# Altium project 25E shutdown bord Rev6 - Copy.PrjPcb
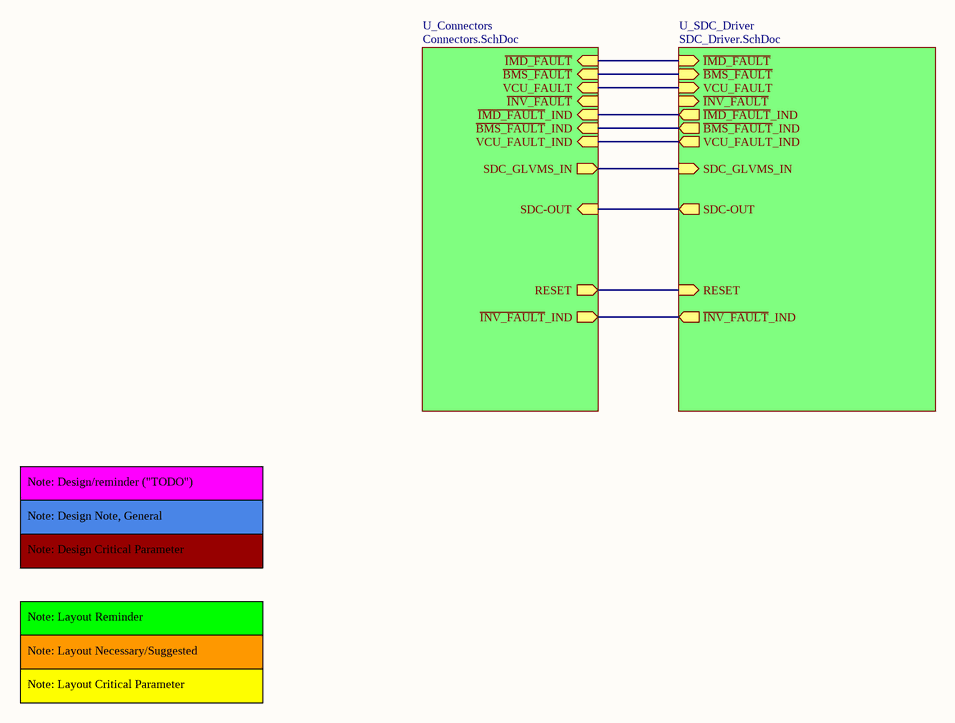
[diagram p0:  Main.SchDoc]
 CAGE_CODE: ?????;  CONTRACT_NUMBER: <CONTRACT NO>;  DOC_NO_ASSY_DWG: <ASSY DWG NO>;  DOC_NO_BOM: <BOM DOC NO>;  DOC_NO_FAB_DWG: <FAB DWG NO>;  DOC_NO_SCH_DWG: <SCH DWG NO>;  PCB_2_DEC_TOL: +/-.01;  PCB_3_DEC_TOL: +/-.010;  PCB_ANG_TOL: +/-1/2;  PCB_ASSEMBLY_NO: <PCB ASSY NO>;  PCB_CHECKER: - -----;  PCB_CHECKER_APP_DATE: --/--/----;  PCB_DESIGNER: - -----;  PCB_DESIGNER_APP_DATE: --/--/----;  PCB_DWG_NO: <PCB DWG NO>;  PCB_ENGINEER: - -----;  PCB_ENGINEER_APP_DATE: --/--/----;  PCB_PART_NUMBER: <PCB PN>;  PCB_REV: A;  SCH_REV: A
6 sheets, 104 parts. Net scope: hierarchical (ports join the sheet entries above them; power ports are global).
Board file:  SCDDB_V_1_0.PcbDoc
Sheets:
   Main.SchDoc
   Connectors.SchDoc
   SDC_Driver.SchDoc
   SDC_Latch_HS.SchDoc
   SDC_LATCH_LS.SchDoc
   Debug.SchDoc

## Sheet  Main.SchDoc
size A; SheetNumber: 1; SheetTotal: 6

### Sub-sheets
U_Connectors = Connectors.SchDoc (file not in this document): ~{IMD_FAULT} (in), ~{BMS_FAULT} (in), VCU_FAULT (in), ~{IMD_FAULT}_IND (in), ~{BMS_FAULT}_IND (in), VCU_FAULT_IND (in), SDC-OUT (in), SDC_GLVMS_IN (out), RESET (out), ~{INV_FAULT} (in), ~{INV_FAULT}_IND (out)
U_SDC_Driver = SDC_Driver.SchDoc (file not in this document): SDC_GLVMS_IN (in), RESET (in), SDC-OUT (out), ~{IMD_FAULT} (in), ~{BMS_FAULT} (in), VCU_FAULT (in), ~{IMD_FAULT}_IND (out), ~{BMS_FAULT}_IND (out), VCU_FAULT_IND (out), ~{INV_FAULT} (in), ~{INV_FAULT}_IND (out)

### Nets
(unnamed): sheet U_Connectors/~{IMD_FAULT}, sheet U_SDC_Driver/~{IMD_FAULT}
(unnamed): sheet U_Connectors/~{BMS_FAULT}, sheet U_SDC_Driver/~{BMS_FAULT}
(unnamed): sheet U_Connectors/VCU_FAULT, sheet U_SDC_Driver/VCU_FAULT
(unnamed): sheet U_Connectors/~{IMD_FAULT}_IND, sheet U_SDC_Driver/~{IMD_FAULT}_IND
(unnamed): sheet U_Connectors/~{BMS_FAULT}_IND, sheet U_SDC_Driver/~{BMS_FAULT}_IND
(unnamed): sheet U_Connectors/VCU_FAULT_IND, sheet U_SDC_Driver/VCU_FAULT_IND
(unnamed): sheet U_Connectors/SDC-OUT, sheet U_SDC_Driver/SDC-OUT
(unnamed): sheet U_Connectors/SDC_GLVMS_IN, sheet U_SDC_Driver/SDC_GLVMS_IN
(unnamed): sheet U_Connectors/RESET, sheet U_SDC_Driver/RESET
(unnamed): sheet U_Connectors/~{INV_FAULT}_IND, sheet U_SDC_Driver/~{INV_FAULT}_IND

### Notes on the sheet
- Note: Design/reminder ("TODO")
- Note: Design Note, General
- Note: Design Critical Parameter
- Note: Layout Reminder
- Note: Layout Necessary/Suggested
- Note: Layout Critical Parameter

## Sheet  Connectors.SchDoc
size 431 x 279 mm; SheetNumber: 2; SheetTotal: 6; ENG_APP_DATE: --/--/--; DSN_APP_DATE: --/--/--; CHK_APP_DATE: --/--/--
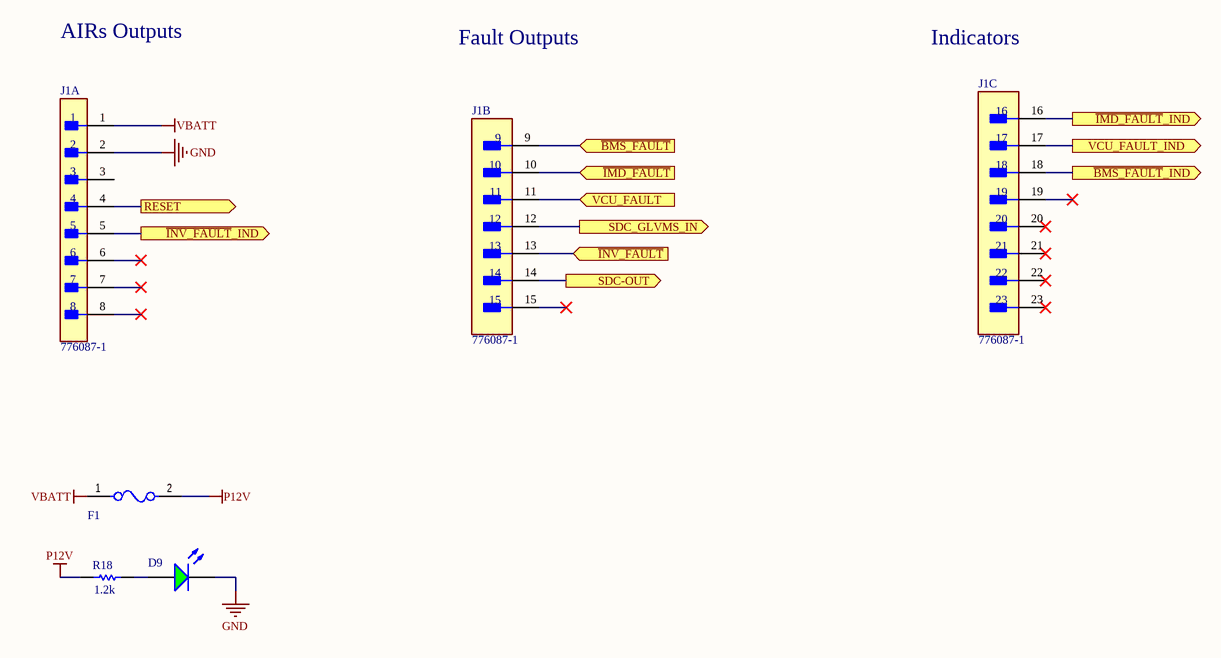
[diagram p1:  Connectors.SchDoc]

### Parts
D9  597-3311-407F  [DIAL-597-3311-407F_V]  (value not drawn)
F1  0468001.NRHF  [FP-437-MFG]  (value not drawn)
J1  776087-1  [FP-776087-1-MFG]  (parts A,B,C of 3)
R18  1.2k  [RESC3216X70X50LL05T20]

### Ports
RESET (out), SDC-OUT (out), SDC_GLVMS_IN (out), VCU_FAULT (in), VCU_FAULT_IND (out), ~{BMS_FAULT} (in), ~{BMS_FAULT}_IND (out), ~{IMD_FAULT} (in), ~{IMD_FAULT}_IND (out), ~{INV_FAULT} (in), ~{INV_FAULT}_IND (out)

### Nets
GND: D9.2(K) J1.2
P12V: F1.2 R18.1
VBATT: F1.1 J1.1
NetD9_1: D9.1(A) R18.2
NetJ1_4: J1.4 ; port RESET
NetJ1_5: J1.5 ; port ~{INV_FAULT}_IND
NetJ1_9: J1.9 ; port ~{BMS_FAULT}
NetJ1_10: J1.10 ; port ~{IMD_FAULT}
NetJ1_11: J1.11 ; port VCU_FAULT
NetJ1_12: J1.12 ; port SDC_GLVMS_IN
NetJ1_13: J1.13 ; port ~{INV_FAULT}
NetJ1_14: J1.14 ; port SDC-OUT
NetJ1_16: J1.16 ; port ~{IMD_FAULT}_IND
NetJ1_17: J1.17 ; port VCU_FAULT_IND
NetJ1_18: J1.18 ; port ~{BMS_FAULT}_IND

Not connected (* = marked no-connect by the designer): J1 3 6* 7* 8* 15* 19* 20* 21* 22* 23*

### Notes on the sheet
- AIRs Outputs
- Fault Outputs
- Indicators
- 8
- 7
- 6
- 5
- 4
- 3
- DWG. NO.
- REV.
- SHT.
- 2
- 1
- THIS DOCUMENT AND THE DATA DISCLOSED HEREIN OR HEREWITH IS THE PROPERTY OF ALTIUM LIMITED AND MAY BE FREELY DISTRIBUTED IN WHOLE. NO RIGHTS ARE RESERVED OR EXPRESS OR IMPLIED WARANTEE GIVEN.
- REVISION
- DESCRIPTION
- DATE
- APPROVED
- F
- E
- D
- C
- B
- ENG:
- APPROVALS
- PROJECT
- SUITE 200
- 2175 SALK AVENUE
- CARLSBAD, CA 92008
- A
- DSN:
- CHK:
- REFERENCE DOCUMENTS
- PROJECT REVISION:
- TITLE
- DOCUMENT REVISION:
- DESIGN ITEM:
- USA
- BOM:
- FAB DWG:
- PCB DWG:
- ASSY DWG:
- SCALE:
- SIZE
- CAGE CODE
- FILE NAME
- DWG NO.
- SHEET
- OF
- REV

### Library data of the parts
D9 = CMP-2000-05651-1: LED Green, 75 mW, 30 mA, -30 to 85 degC, 2-Pin SMD, RoHS, Tape and Reel; Manufacturer: Dialight; Product Depth (mm): 1.5mm; Viewing Angle: 70deg; DELETED: Compliant; Number of  Elements: 1; Emitting Color: YellowGreen; Shape Type: Rectangular; Product Length (mm): 3mm; Forward Current: 30mA; Main Category: ChipLED; Luminous Intensity: 7.5mcd; Type: Uni-Color; High Brightness: No; Test Current (It): 20mA; Lens Type: NonDiffused; Reverse Voltage: 4V; Peak Wavelength: 560nm; Power Dissipation: 75W; Forward Voltage: 2.5V; Chip Material: GaP; Mounting: SurfaceMount; Product Height (mm): 1.5mm; Pin Count: 2; Datasheet URL: https://datasheet.ciiva.com/15117/getdatasheetpartid-142484-15117764.pdf; Mounting Technology: SurfaceMount; Rad Hardened: No; Operating Temperature Classification: Commercial; Lens Dimensions: 2x1.5x0.9mm; Operating Temp Range: -30Cto85C; Package Reference: 597-3311-407F; Package Type: SMD; Datasheet Version: 07/2002; Lum Intensity: 7.5mcd; Packaging: TapeandReel; Package Description: 2-Pin Surface Mount Device, Body 1.5 x 3 mm; Manufacturer URL: http://www.dialight.com/
F1 = CMP-08605-000049-1: FUSE BRD MNT 1A 32VAC 35VDC 1206; Manufacturer: Littelfuse Inc; Manufacturer Part Number: 0437003.WR; Fuse Interrupt Ac Current: 50A; Value: 0.033Ω; Fuse Blow Speed: Fast; Voltage Rating: 32V; Fuse Current: 3A; Max Fuse Dc Voltage: 35V; Fuse I2T: 0.506A2Sec; Fuse Voltage Drop: 0.14V; Octopart: https://octopart.com/0437003.wr-littelfuse-8600121; Category: Fuse; Fuse Interrupt Dc Current: 50A; Temperature: -55°C to +150°C; Device Class L1: Circuit Protection; Temperature Range High: +150°C; Temperature Range Low: -55°C; Resistance: 0.033Ω; Automotive: No; ComponentLink2URL: https://www.littelfuse.com/~/media/electronics/datasheets/fuses/littelfuse_fuse_437_datasheet.pdf.pdf; Ipc Land Pattern Name: CAPC320163X82; Mouser Description: Surface Mount Fuses 32V FA 1206 3A; Device Class L2: Fuses; Device Class L3: unset; Package: 437; RoHS: TRUE; Height: 0.8639mm; Digikey Description: FUSE BRD MNT 3A 32VAC 35VDC 1206; ComponentLink2Description: Datasheet; Lead Free: Yes; Max Fuse Ac Voltage: 32V
J1 = CMP-03369-000157-2: CONN HEADER R/A 23POS 4MM; Max Voltage Rating (AC): 250V; PCB Thickness: 0.062inch; PCB Mount Alignment: Yes (With); Primary Type: Rectangular; Number of Signal Positions: 23; Row Spacing: 0.157inch; Current Rating: 17A; Connector System: Wire-to-Device; Number of Ports: 1; Shielding: Unshielded; PCB Mount Retention: With; Circuit Application: Power; Tab Thickness: 1.3mm; Gender: Male; Contact Shape: Circular; Mount: Through Hole; ELV: Compliant; Orientation: Right Angle; Lead Free: Lead Free; Contact Plating: Tin; Package Quantity: 1; RoHS Compliant: Yes; Connector Type: Header; Series: Ampseal; Termination: Solder; Voltage Rating (AC): 250V; Contact Material: Brass; Number of Rows: 3; Depth: 37.9mm; Housing Material: Polybutylene; Fastening Type: Ramp; Width: 37.9mm; Flammability Rating: UL94 V-0; Housing Color: Black; Radiation Hardening: No; Contact Type: Male Pin; Sealable: Yes (With); Length: 60.8mm; Max Operating Temperature: 221°C; Packaging: Bulk; Number of Positions: 23; Insulation Material: PBT; Pitch: 0.157inch; Contact Finish - Mating: TIN; Color: Black; Number of Terminals/Pins: 23; Insulation Color: Black; Number of Contacts: 23; Min Operating Temperature: -40°C
R18 = CMP-2003-00061-1: ERJ8ENF1201V; Manufacturer: Panasonic; Part Number: ERJ8ENF1201V

## Sheet  SDC_Driver.SchDoc
size 558 x 431 mm; SheetNumber: 3; SheetTotal: 6
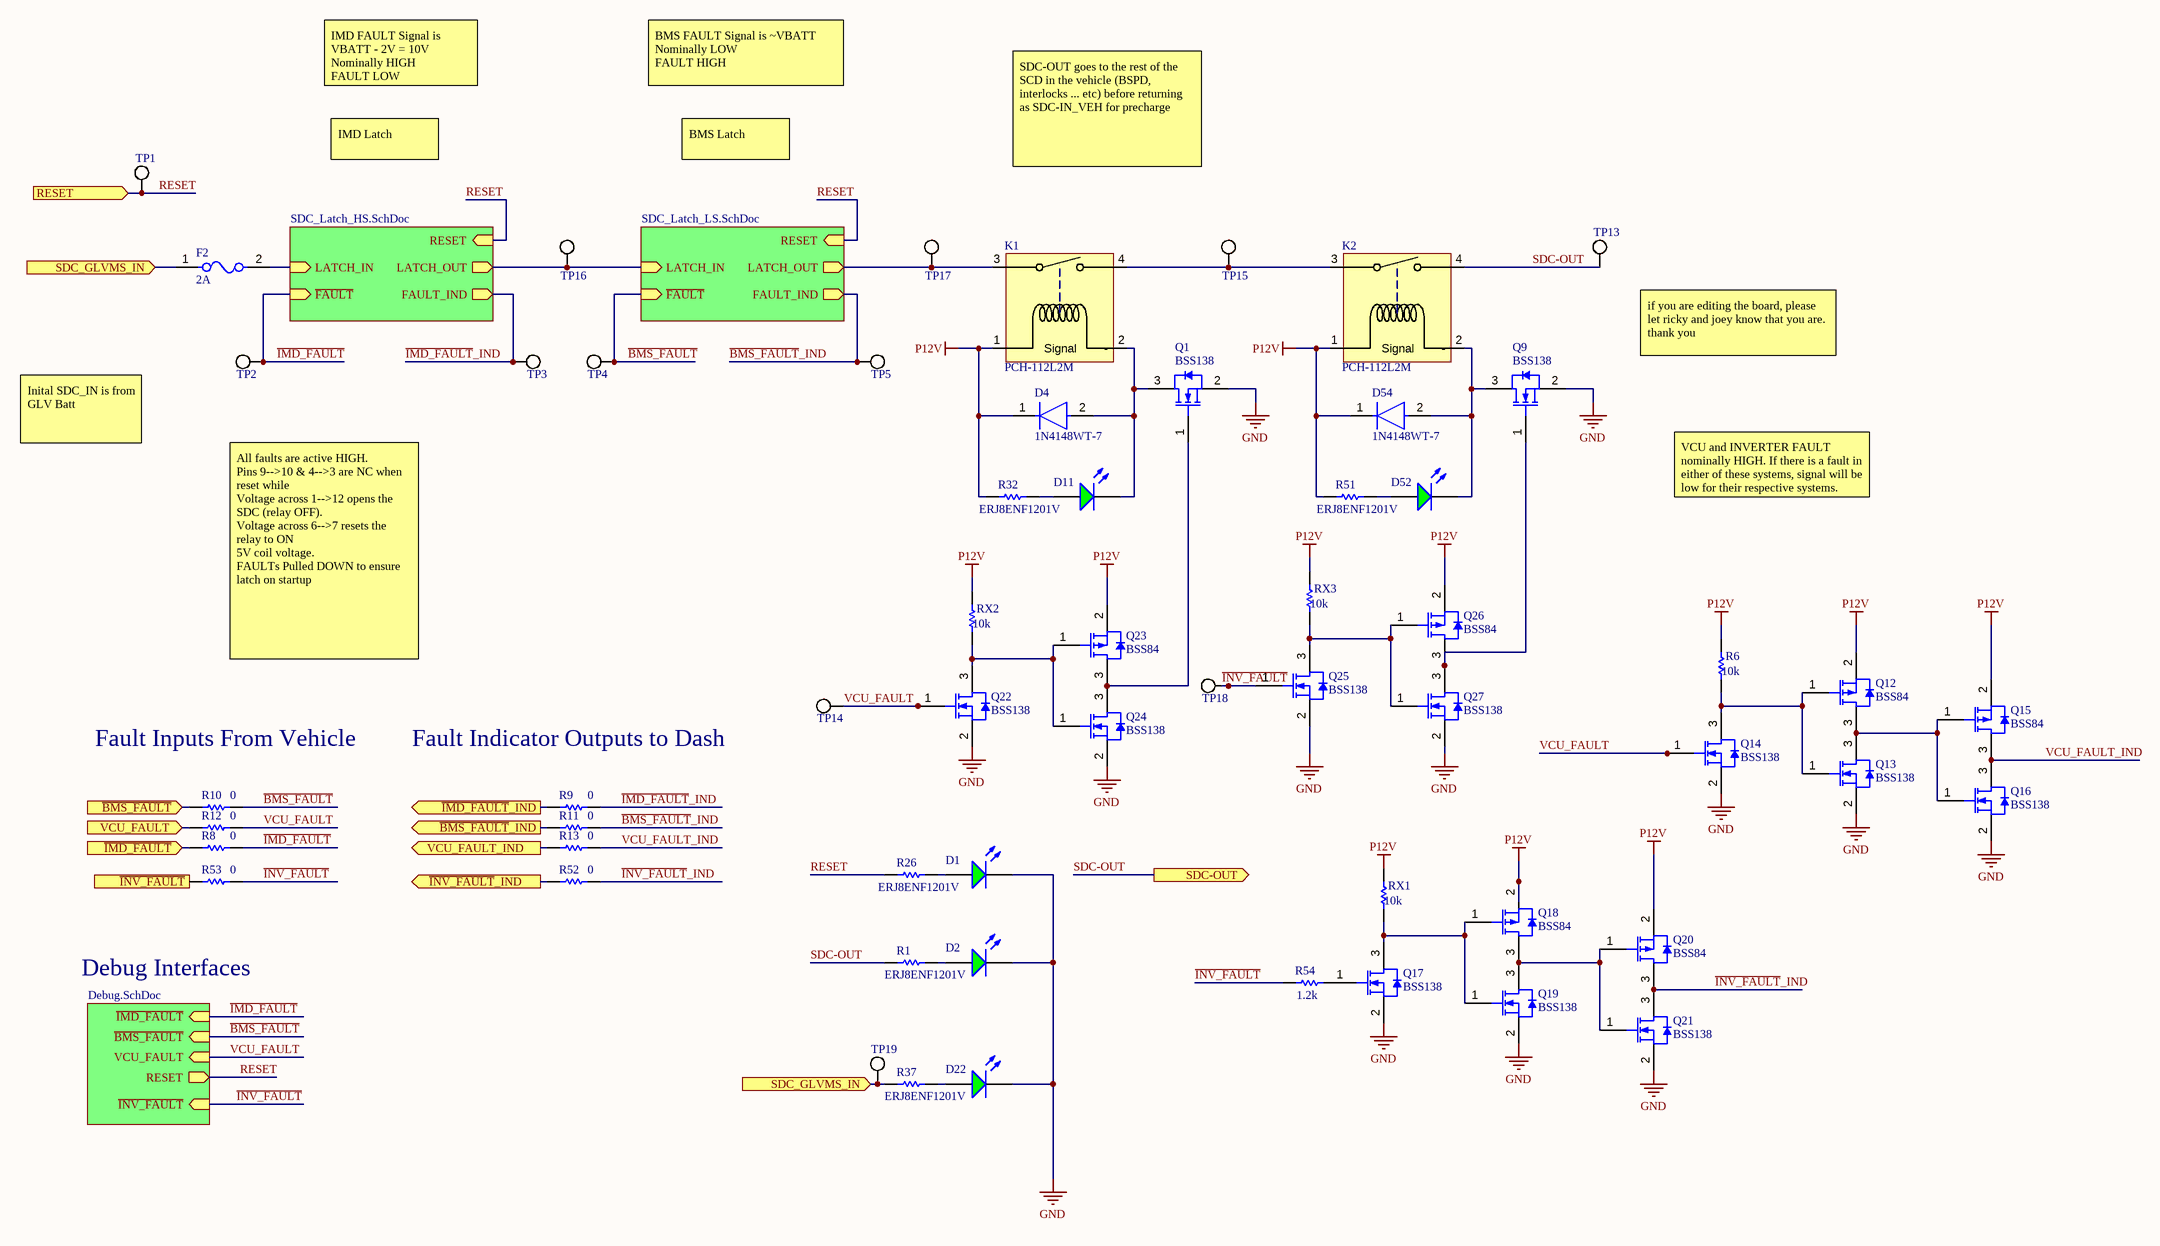
[diagram p2:  SDC_Driver.SchDoc]

### Parts
D1  597-3311-407F  [DIAL-597-3311-407F_V]  (value not drawn)
D2  597-3311-407F  [DIAL-597-3311-407F_V]  (value not drawn)
D4  1N4148WT-7  [FP-SOD523-MFG]
D11  597-3311-407F  [DIAL-597-3311-407F_V]  (value not drawn)
D22  597-3311-407F  [DIAL-597-3311-407F_V]  (value not drawn)
D52  597-3311-407F  [DIAL-597-3311-407F_V]  (value not drawn)
D54  1N4148WT-7  [FP-SOD523-MFG]
F2  Fuse Current: 2A  [FP-0466-MFG]  (hidden comment: 0466002.NR)
K1  PCH-112L2M  [PCH-112L2M]
K2  PCH-112L2M  [PCH-112L2M]
Q1  BSS138  [FAIR-SOT23-3_V]
Q9  BSS138  [FAIR-SOT23-3_V]
Q12  BSS84  [FAIR-SOT23-3_V]
Q13  BSS138  [FAIR-SOT23-3_V]
Q14  BSS138  [FAIR-SOT23-3_V]
Q15  BSS84  [FAIR-SOT23-3_V]
Q16  BSS138  [FAIR-SOT23-3_V]
Q17  BSS138  [FAIR-SOT23-3_V]
Q18  BSS84  [FAIR-SOT23-3_V]
Q19  BSS138  [FAIR-SOT23-3_V]
Q20  BSS84  [FAIR-SOT23-3_V]
Q21  BSS138  [FAIR-SOT23-3_V]
Q22  BSS138  [FAIR-SOT23-3_V]
Q23  BSS84  [FAIR-SOT23-3_V]
Q24  BSS138  [FAIR-SOT23-3_V]
Q25  BSS138  [FAIR-SOT23-3_V]
Q26  BSS84  [FAIR-SOT23-3_V]
Q27  BSS138  [FAIR-SOT23-3_V]
R1  ERJ8ENF1201V  [RESC3216X70X50LL05T20]
R6  10k  [RESC3216X70X50LL20T25]
R8  value 0  [RESC3216X60X45ML15T20]  (hidden comment: Resistor 0R +/- 5% 1206 250 mW)
R9  value 0  [RESC3216X60X45ML15T20]  (hidden comment: Resistor 0R +/- 5% 1206 250 mW)
R10  value 0  [RESC3216X60X45ML15T20]  (hidden comment: Resistor 0R +/- 5% 1206 250 mW)
R11  value 0  [RESC3216X60X45ML15T20]  (hidden comment: Resistor 0R +/- 5% 1206 250 mW)
R12  value 0  [RESC3216X60X45ML15T20]  (hidden comment: Resistor 0R +/- 5% 1206 250 mW)
R13  value 0  [RESC3216X60X45ML15T20]  (hidden comment: Resistor 0R +/- 5% 1206 250 mW)
R26  ERJ8ENF1201V  [RESC3216X70X50LL05T20]
R32  ERJ8ENF1201V  [RESC3216X70X50LL05T20]
R37  ERJ8ENF1201V  [RESC3216X70X50LL05T20]
R51  ERJ8ENF1201V  [RESC3216X70X50LL05T20]
R52  value 0  [RESC3216X60X45ML15T20]  (hidden comment: Resistor 0R +/- 5% 1206 250 mW)
R53  value 0  [RESC3216X60X45ML15T20]  (hidden comment: Resistor 0R +/- 5% 1206 250 mW)
R54  1.2k  [RESC3216X70X50LL05T20]
RX1  10k  [RESC3216X70X50LL20T25]
RX2  10k  [RESC3216X70X50LL20T25]
RX3  10k  [RESC3216X70X50LL20T25]
TP1  Misc-Generic-TP  [FOOTPRINT-GENERIC-TP-VIA-1MM]  (value not drawn)
TP2  Misc-Generic-TP  [FOOTPRINT-GENERIC-TP-VIA-1MM]  (value not drawn)
TP3  Misc-Generic-TP  [FOOTPRINT-GENERIC-TP-VIA-1MM]  (value not drawn)
TP4  Misc-Generic-TP  [FOOTPRINT-GENERIC-TP-VIA-1MM]  (value not drawn)
TP5  Misc-Generic-TP  [FOOTPRINT-GENERIC-TP-VIA-1MM]  (value not drawn)
TP13  Misc-Generic-TP  [FOOTPRINT-GENERIC-TP-VIA-1MM]  (value not drawn)
TP14  Misc-Generic-TP  [FOOTPRINT-GENERIC-TP-VIA-1MM]  (value not drawn)
TP15  Misc-Generic-TP  [FOOTPRINT-GENERIC-TP-VIA-1MM]  (value not drawn)
TP16  Misc-Generic-TP  [FOOTPRINT-GENERIC-TP-VIA-1MM]  (value not drawn)
TP17  Misc-Generic-TP  [FOOTPRINT-GENERIC-TP-VIA-1MM]  (value not drawn)
TP18  Misc-Generic-TP  [FOOTPRINT-GENERIC-TP-VIA-1MM]  (value not drawn)
TP19  Misc-Generic-TP  [FOOTPRINT-GENERIC-TP-VIA-1MM]  (value not drawn)

### Sub-sheets
? = SDC_Latch_HS.SchDoc (file not in this document): ~{FAULT} (in), FAULT_IND (out), RESET (in), LATCH_IN (in), LATCH_OUT (out)
? = SDC_Latch_LS.SchDoc (file not in this document): ~{FAULT} (in), FAULT_IND (out), RESET (in), LATCH_IN (in), LATCH_OUT (out)
? = Debug.SchDoc (file not in this document): ~{IMD_FAULT} (in), ~{BMS_FAULT} (in), VCU_FAULT (in), RESET (out), ~{INV_FAULT} (in)

### Ports
RESET (in), SDC-OUT (out), SDC_GLVMS_IN (in), VCU_FAULT (in), VCU_FAULT_IND (out), ~{BMS_FAULT} (in), ~{BMS_FAULT}_IND (out), ~{IMD_FAULT} (in), ~{IMD_FAULT}_IND (out), ~{INV_FAULT} (in), ~{INV_FAULT}_IND (out)

### Nets
GND: D1.2(K) D2.2(K) D22.2(K) Q1.2(S) Q9.2(S) Q13.2(S) Q14.2(S) Q16.2(S) Q17.2(S) Q19.2(S) Q21.2(S) Q22.2(S) Q24.2(S) Q25.2(S) Q27.2(S)
P12V: D4.1(C) D54.1(C) K1.1(Signal) K2.1(Signal) Q12.2(SOURCE) Q15.2(SOURCE) Q18.2(SOURCE) Q20.2(SOURCE) Q23.2(SOURCE) Q26.2(SOURCE) R6.1 R32.1 R51.1 RX1.1 RX2.1 RX3.1
~{BMS_FAULT}: R10.2 TP4.1(TP) ; sheet /~{FAULT}, sheet /~{BMS_FAULT}
~{BMS_FAULT}_IND: R11.2 TP5.1(TP) ; sheet /FAULT_IND
~{IMD_FAULT}: R8.2 TP2.1(TP) ; sheet /~{FAULT}, sheet /~{IMD_FAULT}
~{IMD_FAULT}_IND: R9.2 TP3.1(TP) ; sheet /FAULT_IND
~{INV_FAULT}: Q25.1(G) R53.2 R54.1 TP18.1(TP) ; sheet /~{INV_FAULT}
~{INV_FAULT}_IND: Q20.3(DRAIN) Q21.3(D) R52.2
RESET: R26.1 TP1.1(TP) ; port RESET, sheet /RESET, sheet /RESET, sheet /RESET
SDC-OUT: K2.4(Switch_1) R1.1 TP13.1(TP) ; port SDC-OUT
VCU_FAULT: Q14.1(G) Q22.1(G) R12.2 TP14.1(TP) ; sheet /VCU_FAULT
VCU_FAULT_IND: Q15.3(DRAIN) Q16.3(D) R13.2
NetD1_1: D1.1(A) R26.2
NetD2_1: D2.1(A) R1.2
NetD4_2: D4.2(A) D11.2(K) K1.2(-) Q1.3(D)
NetD11_1: D11.1(A) R32.2
NetD22_1: D22.1(A) R37.2
NetD52_1: D52.1(A) R51.2
NetD52_2: D52.2(K) D54.2(A) K2.2(-) Q9.3(D)
NetF2_1: F2.1 R37.1 TP19.1(TP) ; port SDC_GLVMS_IN
NetF2_2: F2.2 ; sheet /LATCH_IN
NetK1_3: K1.3(Switch_1) TP17.1(TP) ; sheet /LATCH_OUT
NetK1_4: K1.4(Switch_1) K2.3(Switch_1) TP15.1(TP)
NetQ1_1: Q1.1(G) Q23.3(DRAIN) Q24.3(D)
NetQ9_1: Q9.1(G) Q26.3(DRAIN) Q27.3(D)
NetQ12_1: Q12.1(GATE) Q13.1(G) Q14.3(D) R6.2
NetQ12_3: Q12.3(DRAIN) Q13.3(D) Q15.1(GATE) Q16.1(G)
NetQ17_1: Q17.1(G) R54.2
NetQ17_3: Q17.3(D) Q18.1(GATE) Q19.1(G) RX1.2
NetQ18_3: Q18.3(DRAIN) Q19.3(D) Q20.1(GATE) Q21.1(G)
NetQ22_3: Q22.3(D) Q23.1(GATE) Q24.1(G) RX2.2
NetQ25_3: Q25.3(D) Q26.1(GATE) Q27.1(G) RX3.2
NetR8_1: R8.1 ; port ~{IMD_FAULT}
NetR9_1: R9.1 ; port ~{IMD_FAULT}_IND
NetR10_1: R10.1 ; port ~{BMS_FAULT}
NetR11_1: R11.1 ; port ~{BMS_FAULT}_IND
NetR12_1: R12.1 ; port VCU_FAULT
NetR13_1: R13.1 ; port VCU_FAULT_IND
NetR52_1: R52.1 ; port ~{INV_FAULT}_IND
NetR53_1: R53.1 ; port ~{INV_FAULT}
NetTP16_1: TP16.1(TP) ; sheet /LATCH_OUT, sheet /LATCH_IN

### Notes on the sheet
- IMD FAULT Signal is
  VBATT - 2V = 10V
  Nominally HIGH
  FAULT LOW
- BMS FAULT Signal is ~VBATT
  Nominally LOW
  FAULT HIGH
- IMD Latch
- BMS Latch
- SDC-OUT goes to the rest of the SCD in the vehicle (BSPD, interlocks ... etc) before returning as SDC-IN_VEH for precharge
- if you are editing the board, please let ricky and joey know that you are. thank you
- Inital SDC_IN is from GLV Batt
- VCU and INVERTER FAULT nominally HIGH. If there is a fault in either of these systems, signal will be low for their respective systems. Both signals are 3.3 volts
- All faults are active HIGH.
  Pins 9-->10 & 4-->3 are NC when reset while
  Voltage across 1-->12 opens the SDC (relay OFF).
  Voltage across 6-->7 resets the relay to ON
  5V coil voltage.
  FAULTs Pulled DOWN to ensure latch on startup
- Fault Inputs From Vehicle
- Fault Indicator Outputs to Dash
- Debug Interfaces
- Labels drawn without touching a wire or pin: \
- DWG. NO.
- REV.
- SHT.
- REVISION
- DESCRIPTION
- DATE
- APPROVED
- THIS DOCUMENT AND THE DATA DISCLOSED HEREIN OR HEREWITH IS THE PROPERTY OF ALTIUM LIMITED AND MAY BE FREELY DISTRIBUTED IN WHOLE. NO RIGHTS ARE RESERVED OR EXPRESS OR IMPLIED WARANTEE GIVEN.
- ENG:
- DSN:
- APPROVALS
- PROJECT
- DOCUMENT REVISION:
- DESIGN ITEM:
- CHK:
- BOM:
- REFERENCE DOCUMENTS
- PROJECT REVISION:
- TITLE
- FAB DWG:
- PCB DWG:
- ASSY DWG:
- SCALE:
- SIZE
- C
- CAGE CODE
- FILE NAME
- DWG NO.
- SHEET
- OF
- REV

### Library data of the parts
D1 D2 D11 D22 D52 = CMP-2000-05651-1: as D9 on sheet  Connectors; Mounting: SurfaceMount; Product Height (mm): 1.5mm; Pin Count: 2; Datasheet URL: https://datasheet.ciiva.com/15117/getdatasheetpartid-142484-15117764.pdf; Mounting Technology: SurfaceMount; Rad Hardened: No; Operating Temperature Classification: Commercial; Lens Dimensions: 2x1.5x0.9mm; Operating Temp Range: -30Cto85C; Package Reference: 597-3311-407F; Package Type: SMD; Datasheet Version: 07/2002; Lum Intensity: 7.5mcd; Packaging: TapeandReel; Package Description: 2-Pin Surface Mount Device, Body 1.5 x 3 mm; Manufacturer URL: http://www.dialight.com/
D4 D54 = CMP-2000-05518-3: DIODE GEN PURP 80V 125MA SOD523; Power Rating: 150mW; Peak Non-Repetitive Surge Current: 2A; Forward Voltage: 1.25V; Reverse Recovery Time: 4ns; Peak Reverse Current: 1uA; Max Repetitive Reverse Voltage (Vrrm): 100V; Capacitance: 2pF; Polarity: Standard; Element Configuration: Single; Forward Current: 250mA; Lead Free: Lead Free; Packaging: Tape and Reel; Length: 0.9mm; Min Operating Temperature: -65°C; Current Rating: 125mA; Max Reverse Voltage (DC): 80V; Width: 1.3mm; Package Quantity: 3000; Output Current: 125mA; Power Dissipation: 150mW; Max Operating Temperature: 150°C; Radiation Hardening: No; Average Rectified Current: 125mA; Height: 0.65mm; Voltage Rating (DC): 80V; Max Surge Current: 2A; Weight: 3.5E-05oz; Recovery Time: 4ns; Max Forward Surge Current (Ifsm): 2A; Contact Plating: Tin; Number of Pins: 2; Mount: Surface Mount; REACH SVHC: No SVHC
F2 = CMP-2000-05742-2: FUSE BOARD MNT 2A 63VAC/VDC 1206; Manufacturer: Littelfuse; Max Fuse Dc Voltage: 63V; Fuse I2T: 0.2326A2Sec; Fuse Voltage Drop: 78.73mV; Fuse Interrupt Ac Current: 50A; Resistance: 0.03Ω; Value: 0.03Ω; Fuse Blow Speed: Fast; Temperature Range Low: -55°C; Octopart: https://octopart.com/0466002.nr-littelfuse-566006; Category: Fuse; Digikey Description: FUSE BOARD MNT 2A 63VAC/VDC 1206; Height: 0.66mm; Temperature: -55°C to +90°C; ComponentLink2URL: https://www.littelfuse.com/~/media/electronics/datasheets/fuses/littelfuse_fuse_466_datasheet.pdf.pdf; Device Class L3: unset; Device Class L2: Fuses; Device Class L1: Circuit Protection; Lead Free: Yes; Mouser Description: 466 Series Very Fast-Acting 63 V 2 A 1206 Surface Mount Thin Film Fuse; Package: 0466; Temperature Range High: +90°C; Voltage Rating: 63V; Manufacturer Part Number: 0466002.NR; Automotive: No; Max Fuse Ac Voltage: 63V; ComponentLink2Description: Datasheet; RoHS: TRUE; Fuse Interrupt Dc Current: 50A
K1 K2 = CMP-042-000000-1: Relay SPST 5A 12VDC; Pin Count: 4; Source: Manufacturer-Specified.SchLib; Design Item ID: PCH-112L2M; Component Type: Standard; Datasheet: http://www.te.com/commerce/DocumentDelivery/DDEController?Action=srchrtrv&DocNm=PCH_series_relay_data_sheet_E&DocType=DS&DocLang=English
Q1 Q9 Q13 Q14 Q16 Q17 Q19 Q21 Q22 Q24 Q25 Q27 = CMP-013-00021-2: N-Channel Logic Level Enhancement Mode Field Effect Transistor, 220 mA, 50 V, -55 to 150 degC, 3-Pin SOT-23, RoHS, Tape and Reel; Manufacturer: Fairchild; Nominal Vgs: 1.3V; Rds On Max: 3.5Ohm; Nominal Dual Supply Voltage: 50V; Package Version: Rev. 12, 03/2016; Typical Rise Time: 9ns; Elements: 1; Power: 360mW; Input Capacitance: 27pF; Resistance: 0.7Ohm; Package Reference: SOT23-3; Package Quantity: 1; Pins: 3; Mounting Technology: SM; Datasheet URL: https://www.fairchildsemi.com/datasheets/BS/BSS138.pdf; Max Operating Temperature: 150°C; Min Operating Temperature: -55°C; Datasheet Version: Rev. C, 10/2005; Package Description: 3-Pin Small Outline Transistor, Body 2.92 x 1.325 mm, Pitch 0.95 mm; Case/Package: TO-236-3; Packaging: TapeandReel; RoHS Compliant: True
Q12 Q15 Q18 Q20 Q23 Q26 = CMP-013-00022-2: P-Channel Enhancement Mode Field-Effect Transistor, 0.13 A, 50 V, -55 to 150 degC, 3-Pin SOT23, RoHS, Tape and Reel; Manufacturer: Fairchild; Nominal Dual Supply Voltage: -50V; Input Capacitance: 73pF; Typical Rise Time: 6.3ns; Nominal Vgs: -1.7V; Elements: 1; Rds On Max: 10Ohm; Power: 360mW; Package Version: Rev. 12, 03/2016; Package Quantity: 3000; Package Reference: SOT23-3; RoHS Compliant: True; Mounting Technology: SM; Max Operating Temperature: 150°C; Datasheet URL: https://www.fairchildsemi.com/datasheets/BS/BSS84.pdf; Package Description: 3-Pin Small Outline Transistor, Body 2.92 x 1.325 mm, Pitch 0.95 mm; Datasheet Version: Rev. 1.1.0, 02/2013; Packaging: TapeandReel; Pins: 3; Min Operating Temperature: -55°C; Case/Package: TO-236-3
R1 R26 R32 R37 R51 = CMP-2003-00061-1: Manufacturer: Panasonic; Part Number: ERJ8ENF1201V
R6 RX1-RX3 = CMP-2003-04407-1: Manufacturer: Panasonic; Part Number: ERA8AEB103V
R8-R13 R52 R53 = CMP-009-00002-4: Chip Resistor, 0 Ohm, +/- 5%, 0.25 W, -55 to 155 degC, 1206 (3216 Metric); Voltage Rating: 200V; Power: 250mW; Case/Package: 1206; Mounting Technology: SM; RoHS Compliant: True; Min Operating Temperature: -55°C; Max Operating Temperature: 155°C; Tolerance: 5%; Pins: 2
R54 = CMP-2003-00061-1: ERJ8ENF1201V; Manufacturer: Panasonic; Part Number: ERJ8ENF1201V
TP1-TP5 TP13-TP19 = CMP-025-000000-1: Source: Generic.SchLib; Design Item ID: Misc-Generic-TP

## Sheet  SDC_Latch_HS.SchDoc
size A; SheetNumber: 4; SheetTotal: 6
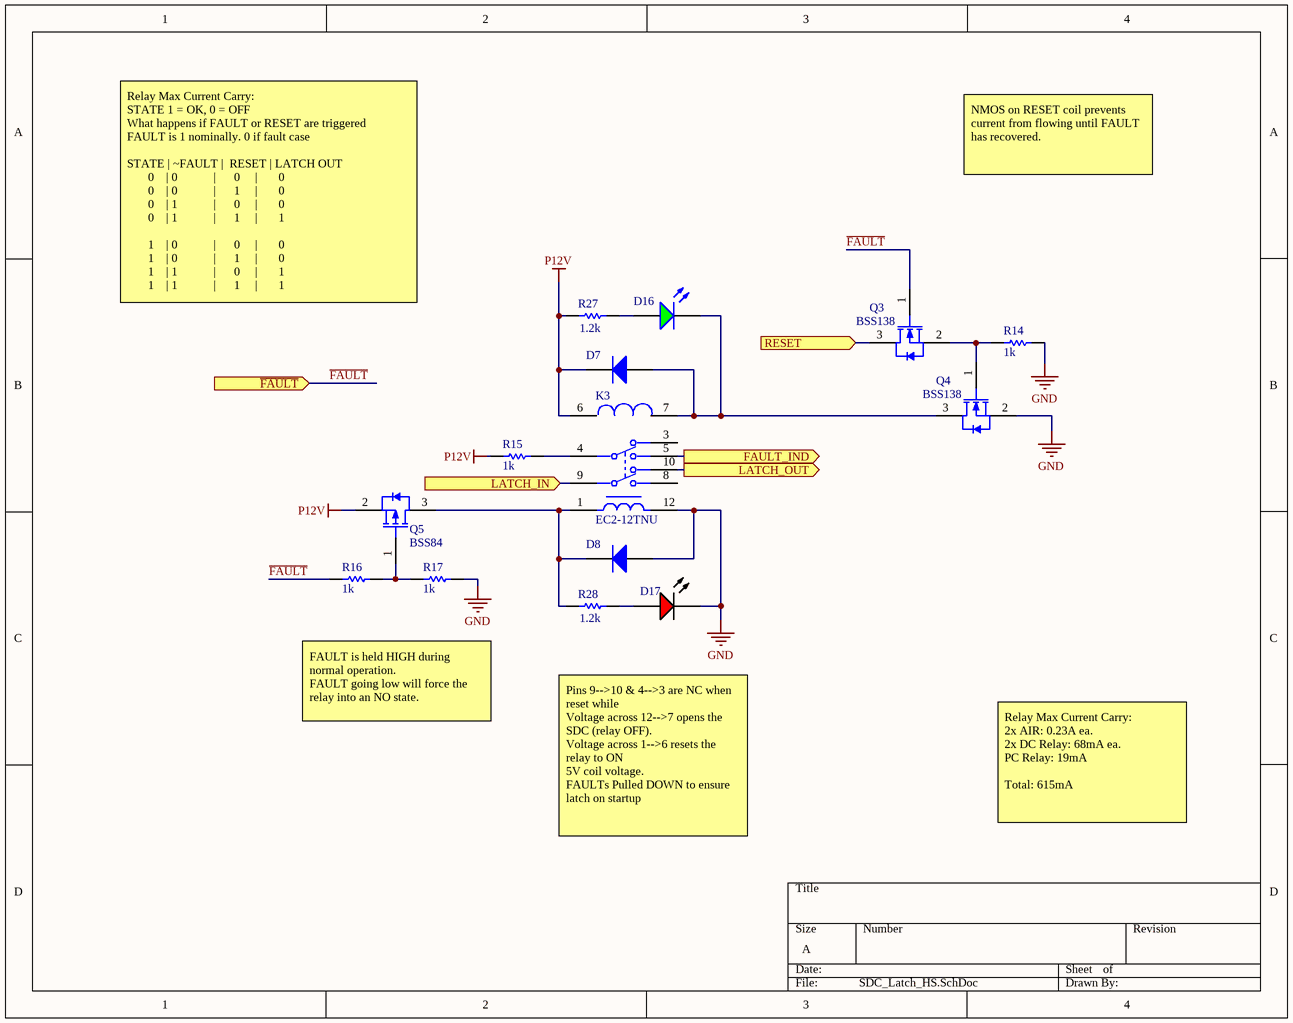
[diagram p3:  SDC_Latch_HS.SchDoc]

### Parts
D7  Diode 1N4148  [DO-35]  (value not drawn)
D8  Diode 1N4148  [DO-35]  (value not drawn)
D16  597-3311-407F  [DIAL-597-3311-407F_V]  (value not drawn)
D17  SML-LX1206IC-TR  [LUMX-SML-LX1206IC_V]  (value not drawn)
K3  EC2-12TNU  [FP-EC2-12TNU-MFG]
Q3  BSS138  [FAIR-SOT23-3_V]
Q4  BSS138  [FAIR-SOT23-3_V]
Q5  BSS84  [FAIR-SOT23-3_V]
R14  value 1k  [RESC3116X70X50ML13T20]  (hidden comment: Resistor 1k +/-1% 1206 250 mW)
R15  value 1k  [RESC3116X70X50ML13T20]  (hidden comment: Resistor 1k +/-1% 1206 250 mW)
R16  value 1k  [RESC3116X70X50ML13T20]  (hidden comment: Resistor 1k +/-1% 1206 250 mW)
R17  value 1k  [RESC3116X70X50ML13T20]  (hidden comment: Resistor 1k +/-1% 1206 250 mW)
R27  1.2k  [RESC3216X70X50LL05T20]
R28  1.2k  [RESC3216X70X50LL05T20]

### Ports
FAULT_IND (out), LATCH_IN (in), LATCH_OUT (out), RESET (in), ~{FAULT} (in)

### Nets
GND: D8.1(A) D17.2(K) K3.12(SET-) Q4.2(S) R14.1 R17.1
P12V: D7.2(K) K3.6(RESET+) Q5.2(SOURCE) R15.2 R27.1
~{FAULT}: Q3.1(G) R16.2 ; port ~{FAULT}
NetD7_1: D7.1(A) D16.2(K) K3.7(RESET-) Q4.3(D)
NetD8_2: D8.2(K) K3.1(SET+) Q5.3(DRAIN) R28.1
NetD16_1: D16.1(A) R27.2
NetD17_1: D17.1(A) R28.2
NetK3_4: K3.4 R15.1
NetK3_5: K3.5 ; port FAULT_IND
NetK3_9: K3.9 ; port LATCH_IN
NetK3_10: K3.10 ; port LATCH_OUT
NetQ3_2: Q3.2(S) Q4.1(G) R14.2
NetQ3_3: Q3.3(D) ; port RESET
NetQ5_1: Q5.1(GATE) R16.1 R17.2

Not connected (* = marked no-connect by the designer): K3 3 8

### Notes on the sheet
- NMOS on RESET coil prevents current from flowing until FAULT has recovered.
- Relay Max Current Carry:
  STATE 1 = OK, 0 = OFF
  What happens if FAULT or RESET are triggered
  FAULT is 1 nominally. 0 if fault case
  STATE | ~FAULT |  RESET | LATCH OUT
  0    | 0            |      0     |       0
  0    | 0            |      1     |       0
  0    | 1            |      0     |       0
  0    | 1            |      1     |       1
  1    | 0            |      0     |       0
  1    | 0            |      1     |       0
  1    | 1            |      0     |       1
  1    | 1            |      1     |       1
- FAULT is held HIGH during normal operation.
  FAULT going low will force the relay into an NO state.
- Pins 9-->10 & 4-->3 are NC when reset while
  Voltage across 12-->7 opens the SDC (relay OFF).
  Voltage across 1-->6 resets the relay to ON
  5V coil voltage.
  FAULTs Pulled DOWN to ensure latch on startup
- Relay Max Current Carry:
  2x AIR: 0.23A ea.
  2x DC Relay: 68mA ea.
  PC Relay: 19mA
  Total: 615mA

### Library data of the parts
D7 D8 = Diode 1N4148: High Conductance Fast Diode; Published: 8-Jun-2000; LatestRevisionDate: 17-Jul-2002; LatestRevisionNote: Re-released for DXP Platform.; DatasheetVersion: 1997; PackageReference: DO-35; Publisher: Altium Limited; PackageDescription: Diode, Axial; Body 3.8 x 1.9 mm (LxDia. max), Lead Dia. 0.53 mm (max); Code_JEDEC: DO-204-AH; ComponentLink1Description: Manufacturer Link; ComponentLink1URL: http://www.fairchildsemi.com/; ComponentLink2Description: Datasheet; ComponentLink2URL: http://www.fairchildsemi.com/ds/1N%2F1N4148.pdf
D16 = CMP-2000-05651-1: as D9 on sheet  Connectors; Mounting: SurfaceMount; Product Height (mm): 1.5mm; Pin Count: 2; Datasheet URL: https://datasheet.ciiva.com/15117/getdatasheetpartid-142484-15117764.pdf; Mounting Technology: SurfaceMount; Rad Hardened: No; Operating Temperature Classification: Commercial; Lens Dimensions: 2x1.5x0.9mm; Operating Temp Range: -30Cto85C; Package Reference: 597-3311-407F; Package Type: SMD; Datasheet Version: 07/2002; Lum Intensity: 7.5mcd; Packaging: TapeandReel; Package Description: 2-Pin Surface Mount Device, Body 1.5 x 3 mm; Manufacturer URL: http://www.dialight.com/
D17 = CMP-2000-07123-1: LED Red, 65 mW, -40 to 85 degC, 2-Pin SMD, RoHS, Tape and Reel; Manufacturer: Lumex; LED Material: GaAsP; Peak Wavelength: 635nm; Number of LEDs: 1; Viewing Angle: 160; Reverse Voltage: 5(Min)V; Lens Appearance: ColorlessNonDiffused; Intensity: 6mcd; Type: Uni-Color; Pin_Count: 2; Lens Dimensions: 2x1.6x0.5mm; Mounting: SurfaceMount; ECCN: EAR99; RoHS: Unknown; Package Description: 2-Pin Surface Mount Device, Body 3.2 x 1.5 mm; Mounting Technology: SurfaceMount; Dominant Wavelength: N/A; Supplier_Package: SMD; Supplier Standard Pack: 3,000; Color: Red; Dimension: 3.2x1.6x1.1mm; HTS: 8541402000; Part No: SML-LX1206IC-TR; Family: SML-LX1206IC; Supplier: Lumex; Datasheet URL: http://www.lumex.com/content/files/ProductAttachment/SML-LX1206IC-TR.pdf; Package Reference: SML-LX1206IC; Manufacturer URL: http://www.lumexinstruments.com/; Operating Temperature: -25to85C; Packaging: TapeandReel; Datasheet Version: Rev. J, 08/2012
K3 = CMP-03195-000005-1: RELAY GEN PURPOSE DPDT 2A 12VDC; Manufacturer: KEMET; Switching Power: 60W; Coil Type: Latching and Dual Coil; Number Of Contacts: 2; Coil Resistance: 1028Ω; Coil Power: 140mW; Coil Voltage: 12V; Height: 9.4mm; Digikey Description: RELAY GEN PURPOSE DPDT 2A 12VDC; Device Class L2: Relays; Ambient Temperature Range High: +85°C; Current Rating: 2A; ComponentLink2Description: Datasheet; Device Class L1: Electromechanical; Switching Current: 2A; Ambient Temperature Range Low: -40°C; Device Class L3: Signal Relays; Package: 0; Octopart: https://octopart.com/ec2-12tnu-kemet-30529205; Throw Configuration: DPDT; Manufacturer Part Number: EC2-12TNU; Mouser Description: Relay; E-Mech; Latching; DPDT; Ctrl-V12DC; 2A; 250VAC; PCB Mnt; Thru Hole; EC2/EE2 Series; RoHS: TRUE; Automotive: No; Lead Free: Yes; Category: Relay; ComponentLink2URL: https://content.kemet.com/datasheets/KEM_R7002_EC2_EE2.pdf
Q3 Q4 = CMP-013-00021-2: as Q1 on sheet  SDC_Driver; Package Reference: SOT23-3; Package Quantity: 1; Pins: 3; Mounting Technology: SM; Datasheet URL: https://www.fairchildsemi.com/datasheets/BS/BSS138.pdf; Max Operating Temperature: 150°C; Min Operating Temperature: -55°C; Datasheet Version: Rev. C, 10/2005; Package Description: 3-Pin Small Outline Transistor, Body 2.92 x 1.325 mm, Pitch 0.95 mm; Case/Package: TO-236-3; Packaging: TapeandReel; RoHS Compliant: True
Q5 = CMP-013-00022-2: as Q12 on sheet  SDC_Driver; Package Quantity: 3000; Package Reference: SOT23-3; RoHS Compliant: True; Mounting Technology: SM; Max Operating Temperature: 150°C; Datasheet URL: https://www.fairchildsemi.com/datasheets/BS/BSS84.pdf; Package Description: 3-Pin Small Outline Transistor, Body 2.92 x 1.325 mm, Pitch 0.95 mm; Datasheet Version: Rev. 1.1.0, 02/2013; Packaging: TapeandReel; Pins: 3; Min Operating Temperature: -55°C; Case/Package: TO-236-3
R14-R17 = CMP-009-00011-4: Chip Resistor, 1 KOhm, +/- 1%, 0.25 W, -55 to 155 degC, 1206 (3216 Metric); Voltage Rating: 200V; Power: 250mW; Max Operating Temperature: 155°C; Case/Package: 1206; Pins: 2; RoHS Compliant: True; Min Operating Temperature: -55°C; Tolerance: 1%; Mounting Technology: SM
R27 R28 = CMP-2003-00061-1: ERJ8ENF1201V; Manufacturer: Panasonic; Part Number: ERJ8ENF1201V

## Sheet  SDC_LATCH_LS.SchDoc
size A; SheetNumber: 5; SheetTotal: 6
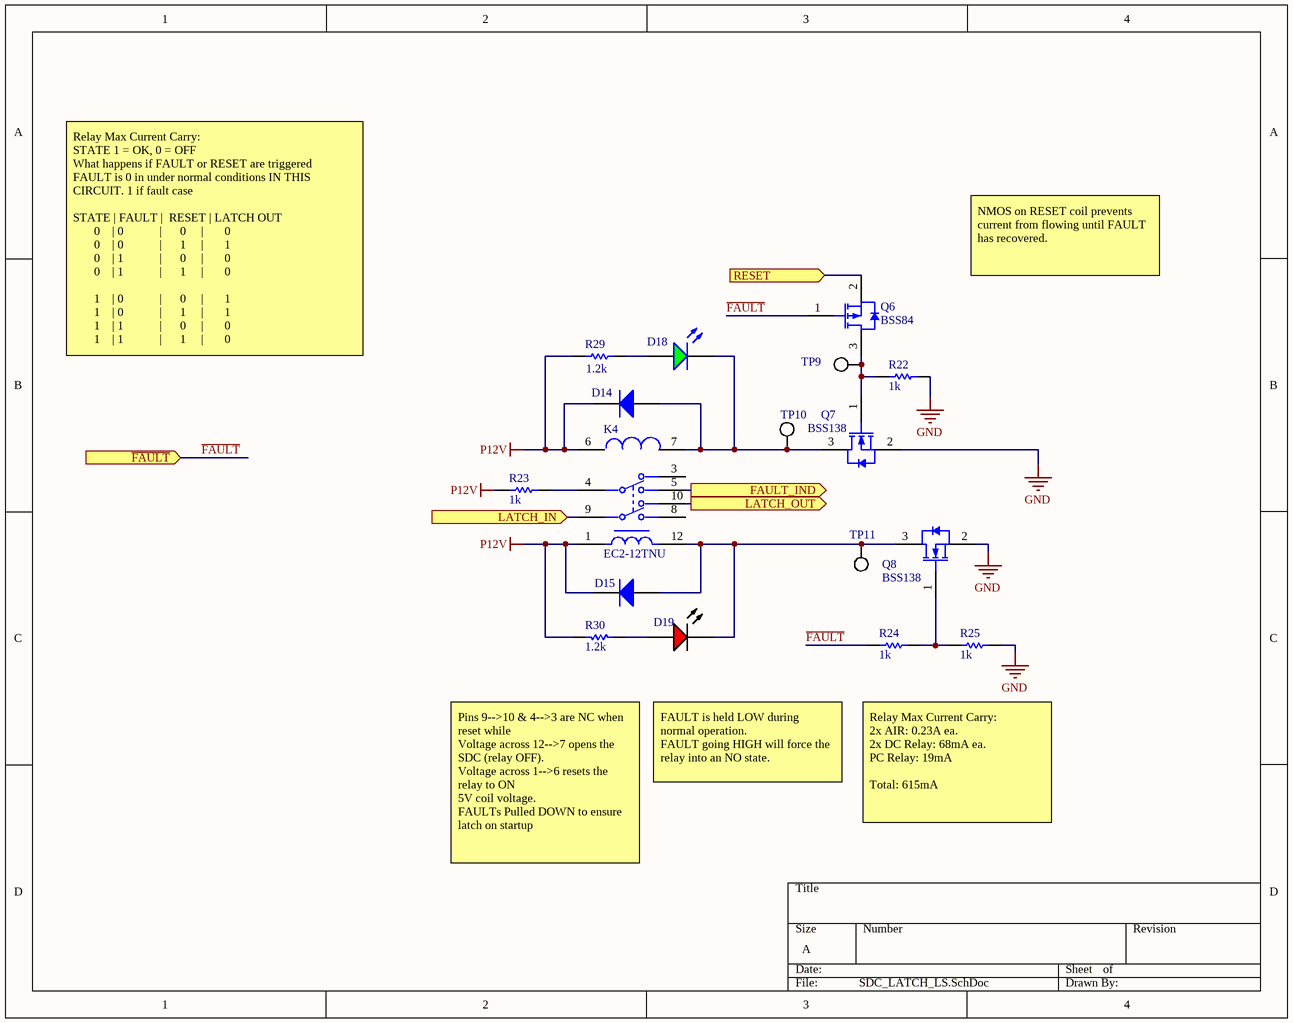
[diagram p4:  SDC_LATCH_LS.SchDoc]

### Parts
D14  Diode 1N4148  [DO-35]  (value not drawn)
D15  Diode 1N4148  [DO-35]  (value not drawn)
D18  597-3311-407F  [DIAL-597-3311-407F_V]  (value not drawn)
D19  SML-LX1206IC-TR  [LUMX-SML-LX1206IC_V]  (value not drawn)
K4  EC2-12TNU  [FP-EC2-12TNU-MFG]
Q6  BSS84  [FAIR-SOT23-3_V]
Q7  BSS138  [FAIR-SOT23-3_V]
Q8  BSS138  [FAIR-SOT23-3_V]
R22  value 1k  [RESC3116X70X50ML13T20]  (hidden comment: Resistor 1k +/-1% 1206 250 mW)
R23  value 1k  [RESC3116X70X50ML13T20]  (hidden comment: Resistor 1k +/-1% 1206 250 mW)
R24  value 1k  [RESC3116X70X50ML13T20]  (hidden comment: Resistor 1k +/-1% 1206 250 mW)
R25  value 1k  [RESC3116X70X50ML13T20]  (hidden comment: Resistor 1k +/-1% 1206 250 mW)
R29  1.2k  [RESC3216X70X50LL05T20]
R30  1.2k  [RESC3216X70X50LL05T20]
TP9  Misc-Generic-TP  [FOOTPRINT-GENERIC-TP-VIA-1MM]  (value not drawn)
TP10  Misc-Generic-TP  [FOOTPRINT-GENERIC-TP-VIA-1MM]  (value not drawn)
TP11  Misc-Generic-TP  [FOOTPRINT-GENERIC-TP-VIA-1MM]  (value not drawn)

### Ports
FAULT_IND (out), LATCH_IN (in), LATCH_OUT (out), RESET (in), ~{FAULT} (in)

### Nets
GND: Q7.2(S) Q8.2(S) R22.1 R25.1
P12V: D14.2(K) D15.2(K) K4.1(SET+) K4.6(RESET+) R23.2 R29.1 R30.1
~{FAULT}: Q6.1(GATE) R24.2 ; port ~{FAULT}
NetD14_1: D14.1(A) D18.2(K) K4.7(RESET-) Q7.3(D) TP10.1(TP)
NetD15_1: D15.1(A) D19.2(K) K4.12(SET-) Q8.3(D) TP11.1(TP)
NetD18_1: D18.1(A) R29.2
NetD19_1: D19.1(A) R30.2
NetK4_4: K4.4 R23.1
NetK4_5: K4.5 ; port FAULT_IND
NetK4_9: K4.9 ; port LATCH_IN
NetK4_10: K4.10 ; port LATCH_OUT
NetQ6_2: Q6.2(SOURCE) ; port RESET
NetQ6_3: Q6.3(DRAIN) Q7.1(G) R22.2 TP9.1(TP)
NetQ8_1: Q8.1(G) R24.1 R25.2

Not connected (* = marked no-connect by the designer): K4 3 8

### Notes on the sheet
- NMOS on RESET coil prevents current from flowing until FAULT has recovered.
- Relay Max Current Carry:
  STATE 1 = OK, 0 = OFF
  What happens if FAULT or RESET are triggered
  FAULT is 0 in under normal conditions IN THIS CIRCUIT. 1 if fault case
  STATE | FAULT |  RESET | LATCH OUT
  0    | 0            |      0     |       0
  0    | 0            |      1     |       1
  0    | 1            |      0     |       0
  0    | 1            |      1     |       0
  1    | 0            |      0     |       1
  1    | 0            |      1     |       1
  1    | 1            |      0     |       0
  1    | 1            |      1     |       0
- FAULT is held LOW during normal operation.
  FAULT going HIGH will force the relay into an NO state.
- Relay Max Current Carry:
  2x AIR: 0.23A ea.
  2x DC Relay: 68mA ea.
  PC Relay: 19mA
  Total: 615mA
- Pins 9-->10 & 4-->3 are NC when reset while
  Voltage across 12-->7 opens the SDC (relay OFF).
  Voltage across 1-->6 resets the relay to ON
  5V coil voltage.
  FAULTs Pulled DOWN to ensure latch on startup

### Library data of the parts
D14 D15 = Diode 1N4148: High Conductance Fast Diode; Published: 8-Jun-2000; LatestRevisionDate: 17-Jul-2002; LatestRevisionNote: Re-released for DXP Platform.; DatasheetVersion: 1997; PackageReference: DO-35; Publisher: Altium Limited; PackageDescription: Diode, Axial; Body 3.8 x 1.9 mm (LxDia. max), Lead Dia. 0.53 mm (max); Code_JEDEC: DO-204-AH; ComponentLink1Description: Manufacturer Link; ComponentLink1URL: http://www.fairchildsemi.com/; ComponentLink2Description: Datasheet; ComponentLink2URL: http://www.fairchildsemi.com/ds/1N%2F1N4148.pdf
D18 = CMP-2000-05651-1: as D9 on sheet  Connectors; Mounting: SurfaceMount; Product Height (mm): 1.5mm; Pin Count: 2; Datasheet URL: https://datasheet.ciiva.com/15117/getdatasheetpartid-142484-15117764.pdf; Mounting Technology: SurfaceMount; Rad Hardened: No; Operating Temperature Classification: Commercial; Lens Dimensions: 2x1.5x0.9mm; Operating Temp Range: -30Cto85C; Package Reference: 597-3311-407F; Package Type: SMD; Datasheet Version: 07/2002; Lum Intensity: 7.5mcd; Packaging: TapeandReel; Package Description: 2-Pin Surface Mount Device, Body 1.5 x 3 mm; Manufacturer URL: http://www.dialight.com/
D19 = CMP-2000-07123-1: as D17 on sheet  SDC_Latch_HS; Lens Dimensions: 2x1.6x0.5mm; Mounting: SurfaceMount; ECCN: EAR99; RoHS: Unknown; Package Description: 2-Pin Surface Mount Device, Body 3.2 x 1.5 mm; Mounting Technology: SurfaceMount; Dominant Wavelength: N/A; Supplier_Package: SMD; Supplier Standard Pack: 3,000; Color: Red; Dimension: 3.2x1.6x1.1mm; HTS: 8541402000; Part No: SML-LX1206IC-TR; Family: SML-LX1206IC; Supplier: Lumex; Datasheet URL: http://www.lumex.com/content/files/ProductAttachment/SML-LX1206IC-TR.pdf; Package Reference: SML-LX1206IC; Manufacturer URL: http://www.lumexinstruments.com/; Operating Temperature: -25to85C; Packaging: TapeandReel; Datasheet Version: Rev. J, 08/2012
K4 = CMP-03195-000005-1: as K3 on sheet  SDC_Latch_HS; Height: 9.4mm; Digikey Description: RELAY GEN PURPOSE DPDT 2A 12VDC; Device Class L2: Relays; Ambient Temperature Range High: +85°C; Current Rating: 2A; ComponentLink2Description: Datasheet; Device Class L1: Electromechanical; Switching Current: 2A; Ambient Temperature Range Low: -40°C; Device Class L3: Signal Relays; Package: 0; Octopart: https://octopart.com/ec2-12tnu-kemet-30529205; Throw Configuration: DPDT; Manufacturer Part Number: EC2-12TNU; Mouser Description: Relay; E-Mech; Latching; DPDT; Ctrl-V12DC; 2A; 250VAC; PCB Mnt; Thru Hole; EC2/EE2 Series; RoHS: TRUE; Automotive: No; Lead Free: Yes; Category: Relay; ComponentLink2URL: https://content.kemet.com/datasheets/KEM_R7002_EC2_EE2.pdf
Q6 = CMP-013-00022-2: as Q12 on sheet  SDC_Driver; Package Quantity: 3000; Package Reference: SOT23-3; RoHS Compliant: True; Mounting Technology: SM; Max Operating Temperature: 150°C; Datasheet URL: https://www.fairchildsemi.com/datasheets/BS/BSS84.pdf; Package Description: 3-Pin Small Outline Transistor, Body 2.92 x 1.325 mm, Pitch 0.95 mm; Datasheet Version: Rev. 1.1.0, 02/2013; Packaging: TapeandReel; Pins: 3; Min Operating Temperature: -55°C; Case/Package: TO-236-3
Q7 Q8 = CMP-013-00021-2: as Q1 on sheet  SDC_Driver; Package Reference: SOT23-3; Package Quantity: 1; Pins: 3; Mounting Technology: SM; Datasheet URL: https://www.fairchildsemi.com/datasheets/BS/BSS138.pdf; Max Operating Temperature: 150°C; Min Operating Temperature: -55°C; Datasheet Version: Rev. C, 10/2005; Package Description: 3-Pin Small Outline Transistor, Body 2.92 x 1.325 mm, Pitch 0.95 mm; Case/Package: TO-236-3; Packaging: TapeandReel; RoHS Compliant: True
R22-R25 = CMP-009-00011-4: as R14 on sheet  SDC_Latch_HS; Max Operating Temperature: 155°C; Case/Package: 1206; Pins: 2; RoHS Compliant: True; Min Operating Temperature: -55°C; Tolerance: 1%; Mounting Technology: SM
R29 R30 = CMP-2003-00061-1: ERJ8ENF1201V; Manufacturer: Panasonic; Part Number: ERJ8ENF1201V
TP9-TP11 = CMP-025-000000-1: Source: Generic.SchLib; Design Item ID: Misc-Generic-TP

## Sheet  Debug.SchDoc
size A; SheetNumber: 6; SheetTotal: 6
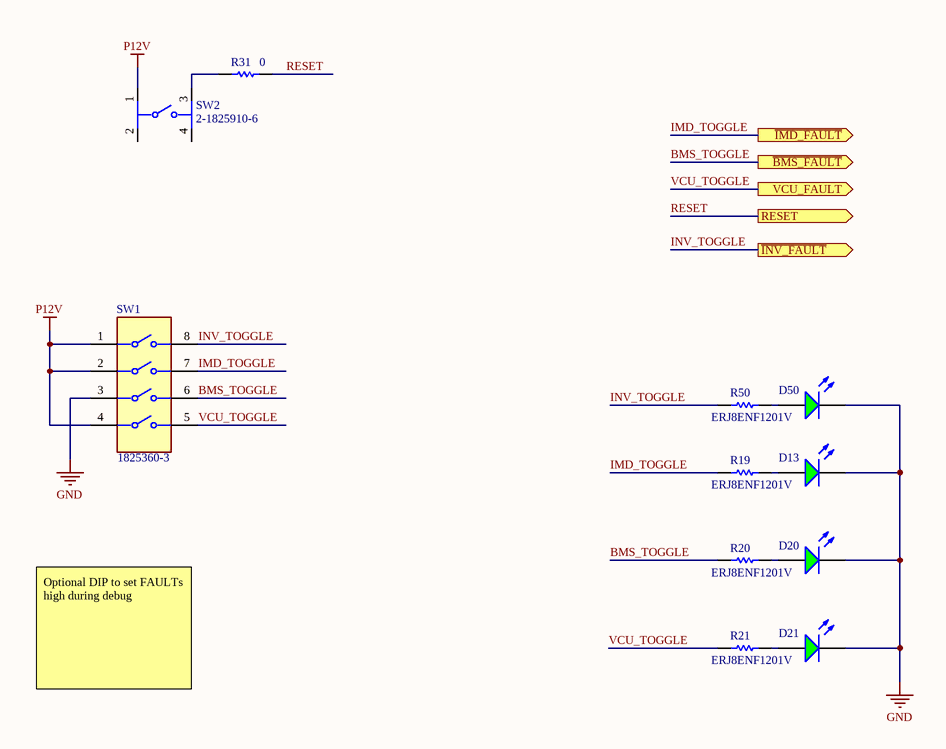
[diagram p5:  Debug.SchDoc]

### Parts
D13  597-3311-407F  [DIAL-597-3311-407F_V]  (value not drawn)
D20  597-3311-407F  [DIAL-597-3311-407F_V]  (value not drawn)
D21  597-3311-407F  [DIAL-597-3311-407F_V]  (value not drawn)
D50  597-3311-407F  [DIAL-597-3311-407F_V]  (value not drawn)
R19  ERJ8ENF1201V  [RESC3216X70X50LL05T20]
R20  ERJ8ENF1201V  [RESC3216X70X50LL05T20]
R21  ERJ8ENF1201V  [RESC3216X70X50LL05T20]
R31  value 0  [RESC3216X60X45ML15T20]  (hidden comment: Resistor 0R +/- 5% 1206 250 mW)
R50  ERJ8ENF1201V  [RESC3216X70X50LL05T20]
SW1  1825360-3  [FP-1825360-3-MFG]
SW2  2-1825910-6  [FP-2-1825910-6-MFG]

### Ports
RESET (out), VCU_FAULT (out), ~{BMS_FAULT} (out), ~{IMD_FAULT} (out), ~{INV_FAULT} (out)

### Nets
GND: D13.2(K) D20.2(K) D21.2(K) D50.2(K) SW1.3
P12V: SW1.1 SW1.2 SW1.4 SW2.1
BMS_TOGGLE: R20.1 SW1.6 ; port ~{BMS_FAULT}
IMD_TOGGLE: R19.1 SW1.7 ; port ~{IMD_FAULT}
INV_TOGGLE: R50.1 SW1.8 ; port ~{INV_FAULT}
RESET: R31.2 ; port RESET
VCU_TOGGLE: R21.1 SW1.5 ; port VCU_FAULT
NetD13_1: D13.1(A) R19.2
NetD20_1: D20.1(A) R20.2
NetD21_1: D21.1(A) R21.2
NetD50_1: D50.1(A) R50.2
NetR31_1: R31.1 SW2.3

Not connected (* = marked no-connect by the designer): SW2 2 4

### Notes on the sheet
- Optional DIP to set FAULTs high during debug

### Library data of the parts
D13 D20 D21 D50 = CMP-2000-05651-1: as D9 on sheet  Connectors; Mounting: SurfaceMount; Product Height (mm): 1.5mm; Pin Count: 2; Datasheet URL: https://datasheet.ciiva.com/15117/getdatasheetpartid-142484-15117764.pdf; Mounting Technology: SurfaceMount; Rad Hardened: No; Operating Temperature Classification: Commercial; Lens Dimensions: 2x1.5x0.9mm; Operating Temp Range: -30Cto85C; Package Reference: 597-3311-407F; Package Type: SMD; Datasheet Version: 07/2002; Lum Intensity: 7.5mcd; Packaging: TapeandReel; Package Description: 2-Pin Surface Mount Device, Body 1.5 x 3 mm; Manufacturer URL: http://www.dialight.com/
R19-R21 R50 = CMP-2003-00061-1: Manufacturer: Panasonic; Part Number: ERJ8ENF1201V
R31 = CMP-009-00002-4: as R8 on sheet  SDC_Driver; Case/Package: 1206; Mounting Technology: SM; RoHS Compliant: True; Min Operating Temperature: -55°C; Max Operating Temperature: 155°C; Tolerance: 5%; Pins: 2
SW1 = CMP-03400-000022-1: SWITCH SLIDE DIP SPST 100MA 24V; Washable: Yes; Contact Current Rating: 1A; Electrical Life: 1000Cycles; Number of Circuits: 4; Pitch: 0.1inch; Actuator Length: 0.99mm; Contact Resistance: 50mR; Actuator Type: Standard; Contact Post Length: 4mm; Voltage Rating (DC): 5V; Actuator Material: Polybutylene; Sealable: No (Without); Max Voltage Rating (DC): 24V; Throw Configuration: SPST; Mount: Through Hole; Type: Switch; RoHS Compliant: Yes; Min Operating Temperature: -30°C; Max Operating Temperature: 85°C; Orientation: Straight; Packaging: Rail/Tube; Series: ADE; Lead Free: Lead Free; Depth: 7.49mm; Flammability Rating: UL94 V-0; Radiation Hardening: No; Terminal Pitch: 2.54mm; Package Quantity: 35; Contact Material: Copper Alloy; Housing Color: Black; Number of Positions: 4; Length: 0.476inch; ELV: Compliant; Termination: PC Pins; Housing Material: Polyphenylene; Contact Plating: Gold; Max Current Rating: 100mA; Height: 0.138inch
SW2 = CMP-03407-000025-1: SWITCH TACTILE SPST-NO 0.05A 24V; Max Current Rating: 50mA; Actuator Type: Standard; Illumination Type: Non-Illuminated; Actuator Material: Nylon; Throw Configuration: SPST; Actuator Length: 0.37inch; Operating Force: 100gf; Switch Function: Off-Mom; Mechanical Life: 100000Cycles; Actuator Color: Brown; Switch Travel: 0.25mm; Packaging: Loose Piece; Series: FSMJ; RoHS Compliant: Yes; Mount: Through Hole; Lead Free: Lead Free; Length: 5.99mm; Voltage Rating (DC): 24V; Type: Switch; Contact Current Rating: 50mA; Contact Material: Copper Alloy; Max Operating Temperature: 85°C; Min Operating Temperature: -35°C; Termination: PC Pin; ELV: Compliant; Orientation: Straight; Contact Plating: Silver

## Nets that join several sheets
GND:  Connectors (D9.2 J1.2),  SDC_Driver (15 pins),  SDC_Latch_HS (6 pins),  SDC_LATCH_LS (Q7.2 Q8.2 R22.1 R25.1),  Debug (5 pins)
P12V:  Connectors (F1.2 R18.1),  SDC_Driver (16 pins),  SDC_Latch_HS (5 pins),  SDC_LATCH_LS (7 pins),  Debug (SW1.1 SW1.2 SW1.4 SW2.1)